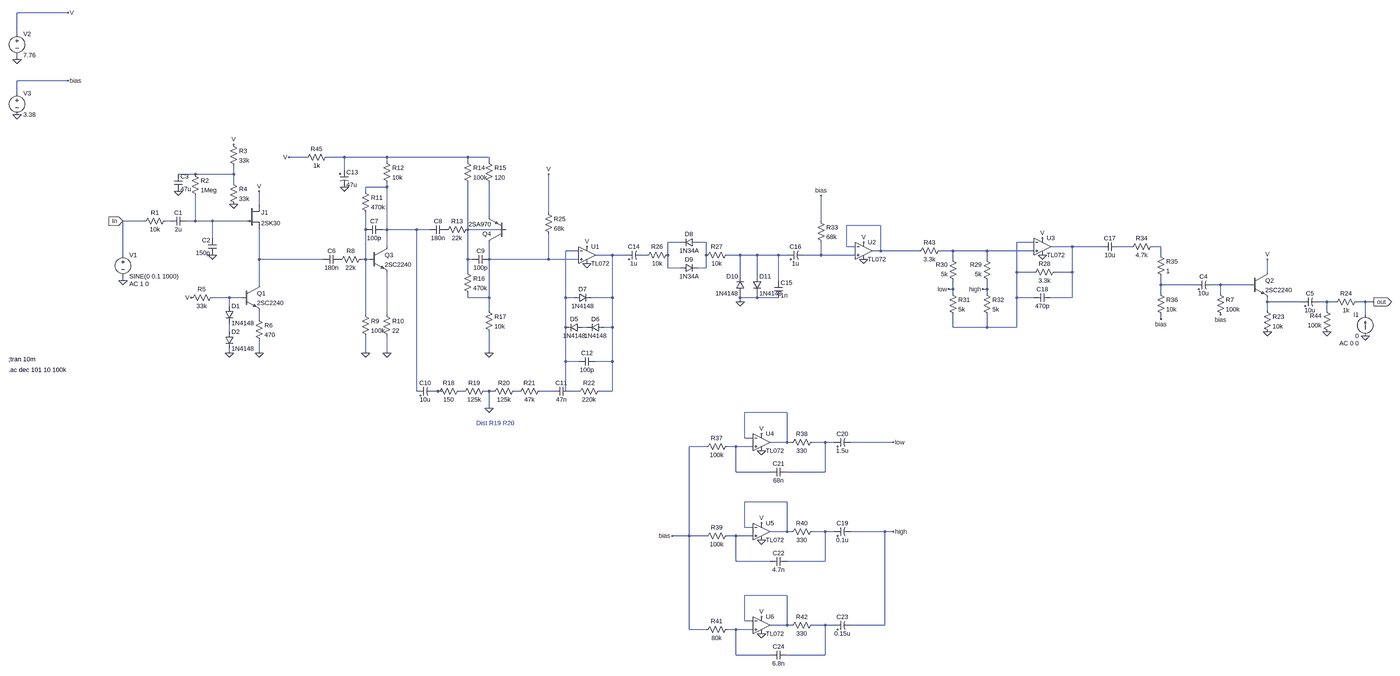
[diagram p0: schematic Narcissu.asc, whole sheet]
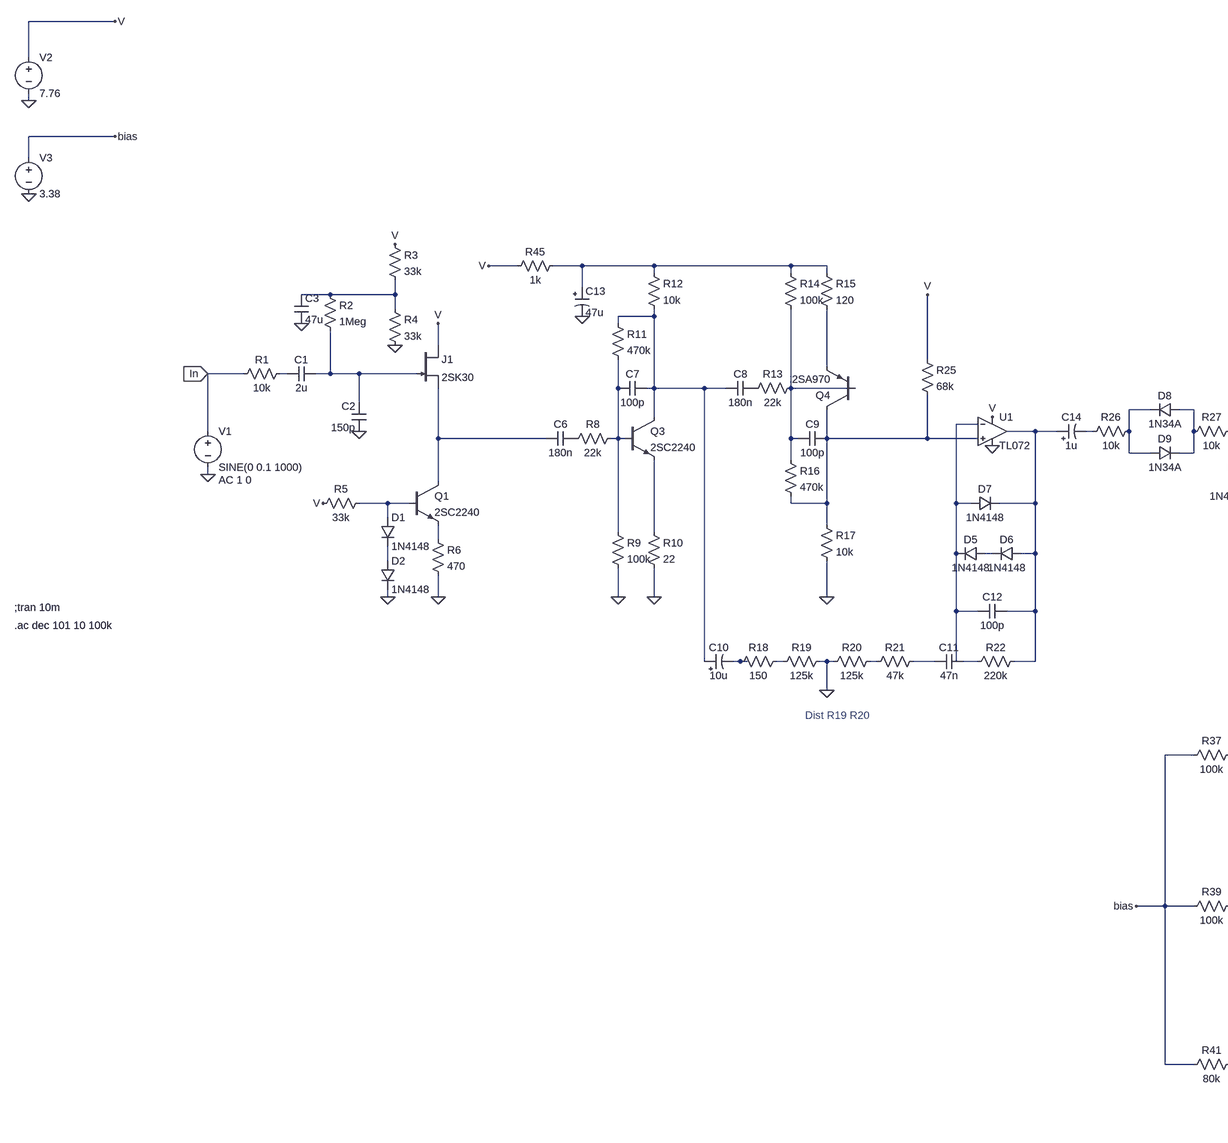
[diagram p1: schematic Narcissu.asc, part, row 1 of 1, column 1 of 2]
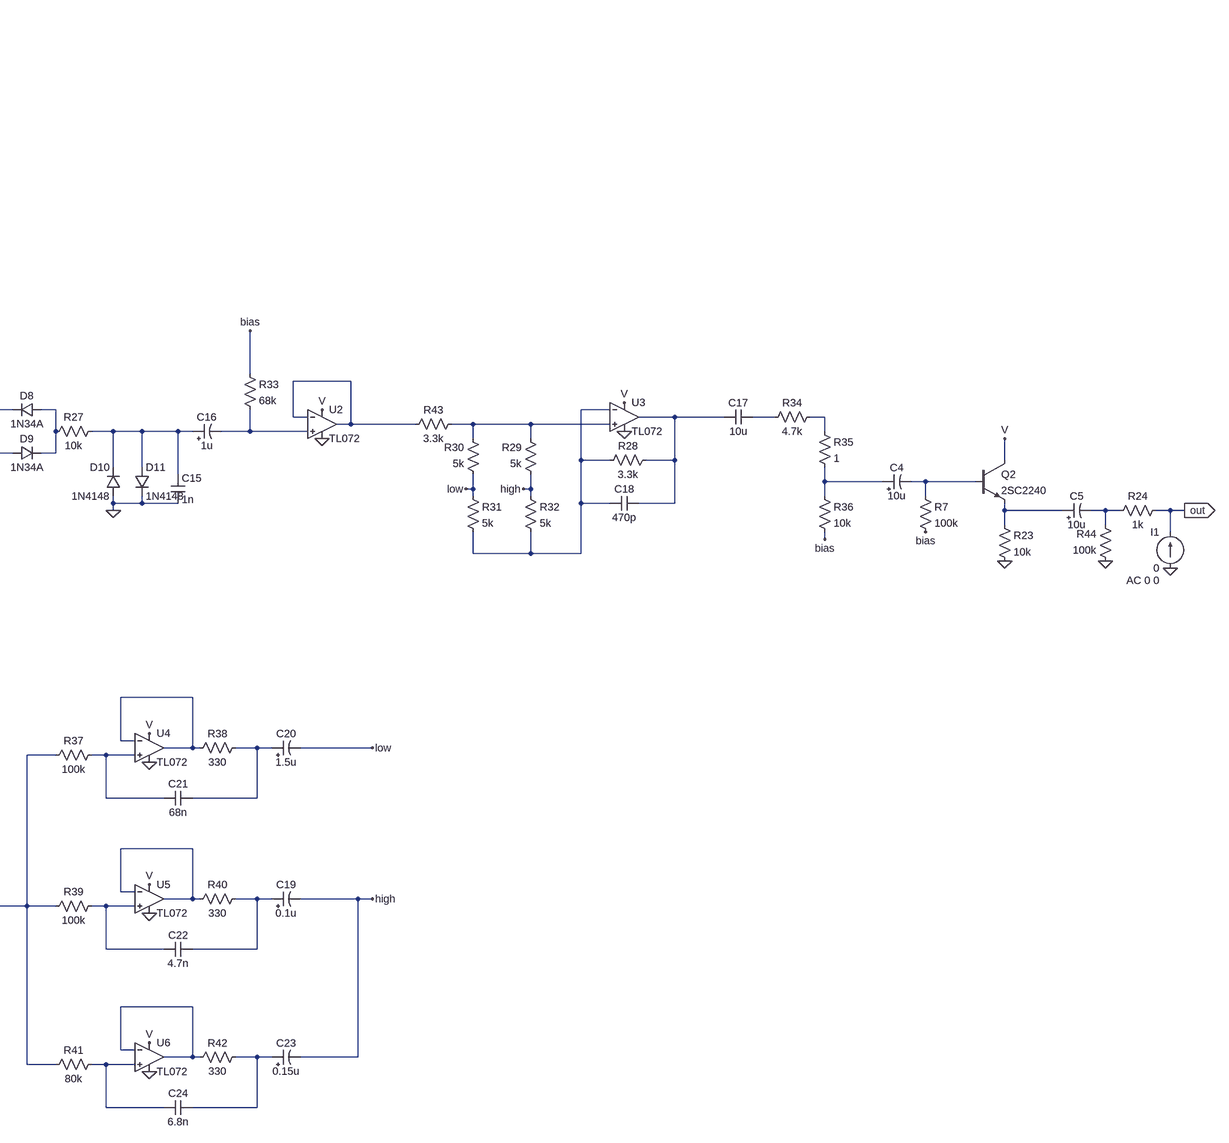
[diagram p2: schematic Narcissu.asc, part, row 1 of 1, column 2 of 2]
Narcissu.asc, the LTspice schematic file:
Version 4
SHEET 1 4928 1632
WIRE -224 -832 -416 -832
WIRE -416 -752 -416 -832
WIRE -416 -656 -416 -672
WIRE -224 -576 -416 -576
WIRE -416 -528 -416 -576
WIRE 672 -288 608 -288
WIRE 816 -288 752 -288
WIRE 976 -288 816 -288
WIRE 1280 -288 976 -288
WIRE 1360 -288 1280 -288
WIRE 976 -272 976 -288
WIRE 1280 -272 1280 -288
WIRE 1360 -272 1360 -288
WIRE 816 -240 816 -288
WIRE 256 -224 192 -224
WIRE 400 -224 400 -256
WIRE 400 -224 256 -224
WIRE 400 -192 400 -224
WIRE 976 -176 976 -192
WIRE 976 -176 896 -176
WIRE 896 -160 896 -176
WIRE 496 -112 496 -160
WIRE 1584 -80 1584 -224
WIRE 1360 -64 1360 -192
WIRE 64 -48 -16 -48
WIRE 160 -48 144 -48
WIRE 256 -48 256 -144
WIRE 256 -48 224 -48
WIRE 320 -48 256 -48
WIRE 448 -48 320 -48
WIRE 2608 -48 2608 -144
WIRE 2832 -32 2704 -32
WIRE 896 -16 896 -80
WIRE 976 -16 976 -176
WIRE 976 -16 960 -16
WIRE 1088 -16 976 -16
WIRE 1136 -16 1088 -16
WIRE 1280 -16 1280 -192
WIRE 1424 -16 1280 -16
WIRE 320 16 320 -48
WIRE 2080 32 2032 32
WIRE 2176 32 2144 32
WIRE 3408 32 3344 32
WIRE 976 48 976 -16
WIRE 2704 48 2704 -32
WIRE 2736 48 2704 48
WIRE 3552 48 3472 48
WIRE 3760 48 3552 48
WIRE 3872 48 3824 48
WIRE 3984 48 3952 48
WIRE 1696 64 1648 64
WIRE 2832 64 2832 -32
WIRE 2832 64 2800 64
WIRE 2976 64 2832 64
WIRE 3104 64 3056 64
WIRE 3232 64 3104 64
WIRE 3408 64 3232 64
WIRE -16 80 -16 -48
WIRE 1824 80 1760 80
WIRE 1872 80 1824 80
WIRE 1952 80 1936 80
WIRE 2032 80 2032 32
WIRE 2176 80 2176 32
WIRE 2304 80 2256 80
WIRE 2368 80 2304 80
WIRE 2448 80 2368 80
WIRE 2480 80 2448 80
WIRE 2608 80 2608 32
WIRE 2608 80 2544 80
WIRE 2736 80 2608 80
WIRE 3984 80 3984 48
WIRE 496 96 496 -16
WIRE 736 96 496 96
WIRE 896 96 896 -16
WIRE 896 96 880 96
WIRE 912 96 896 96
WIRE 1280 96 1280 -16
WIRE 1296 96 1280 96
WIRE 1360 96 1360 32
WIRE 1584 96 1584 0
WIRE 1584 96 1360 96
WIRE 1696 96 1584 96
WIRE 3104 96 3104 64
WIRE 3232 96 3232 64
WIRE 2032 128 2032 80
WIRE 2080 128 2032 128
WIRE 2176 128 2176 80
WIRE 2176 128 2144 128
WIRE 1280 144 1280 96
WIRE 3344 144 3344 32
WIRE 3408 144 3344 144
WIRE 3552 144 3552 48
WIRE 3552 144 3488 144
WIRE 4384 144 4384 96
WIRE 2304 160 2304 80
WIRE 2368 160 2368 80
WIRE -16 176 -16 160
WIRE 2448 176 2448 80
WIRE 496 192 496 96
WIRE 3984 192 3984 160
WIRE 4112 192 3984 192
WIRE 4208 192 4176 192
WIRE 4320 192 4208 192
WIRE 3104 208 3104 176
WIRE 3104 208 3088 208
WIRE 3232 208 3232 176
WIRE 3232 208 3216 208
WIRE 3104 224 3104 208
WIRE 3232 224 3232 208
WIRE 3984 224 3984 192
WIRE 4208 224 4208 192
WIRE 384 240 320 240
WIRE 432 240 384 240
WIRE 1280 240 1280 224
WIRE 1360 240 1360 96
WIRE 1360 240 1280 240
WIRE 1648 240 1648 64
WIRE 1680 240 1648 240
WIRE 1824 240 1824 80
WIRE 1824 240 1744 240
WIRE 2304 240 2304 224
WIRE 2368 240 2368 224
WIRE 2368 240 2304 240
WIRE 2448 240 2368 240
WIRE 3344 240 3344 144
WIRE 3408 240 3344 240
WIRE 3552 240 3552 144
WIRE 3552 240 3472 240
WIRE 2304 256 2304 240
WIRE 4384 256 4384 240
WIRE 4512 256 4384 256
WIRE 4608 256 4576 256
WIRE 4640 256 4608 256
WIRE 4752 256 4720 256
WIRE 4784 256 4752 256
WIRE 384 272 384 240
WIRE 1360 288 1360 240
WIRE 4384 288 4384 256
WIRE 4608 288 4608 256
WIRE 896 304 896 96
WIRE 976 304 976 144
WIRE 4752 304 4752 256
WIRE 496 320 496 288
WIRE 3984 320 3984 304
WIRE 1648 352 1648 240
WIRE 1728 352 1712 352
WIRE 1824 352 1824 240
WIRE 1824 352 1792 352
WIRE 3104 352 3104 304
WIRE 3232 352 3232 304
WIRE 3232 352 3104 352
WIRE 3344 352 3344 240
WIRE 3344 352 3232 352
WIRE 384 368 384 336
WIRE 384 448 384 432
WIRE 496 448 496 400
WIRE 896 448 896 384
WIRE 976 448 976 384
WIRE 1360 448 1360 368
WIRE 1648 480 1648 352
WIRE 1696 480 1648 480
WIRE 1824 480 1824 352
WIRE 1824 480 1760 480
WIRE 1088 592 1088 -16
WIRE 1168 592 1152 592
WIRE 1184 592 1168 592
WIRE 1264 592 1248 592
WIRE 1360 592 1344 592
WIRE 1376 592 1360 592
WIRE 1472 592 1456 592
WIRE 1600 592 1552 592
WIRE 1648 592 1648 480
WIRE 1696 592 1664 592
WIRE 1824 592 1824 480
WIRE 1824 592 1776 592
WIRE 1360 656 1360 592
WIRE 2480 672 2320 672
WIRE 2320 768 2320 672
WIRE 2352 768 2320 768
WIRE 2480 784 2480 672
WIRE 2480 784 2416 784
WIRE 2496 784 2480 784
WIRE 2624 784 2576 784
WIRE 2656 784 2624 784
WIRE 2880 784 2720 784
WIRE 2176 800 2112 800
WIRE 2288 800 2256 800
WIRE 2352 800 2288 800
WIRE 2288 896 2288 800
WIRE 2416 896 2288 896
WIRE 2624 896 2624 784
WIRE 2624 896 2480 896
WIRE 2480 1008 2320 1008
WIRE 2320 1104 2320 1008
WIRE 2352 1104 2320 1104
WIRE 2480 1120 2480 1008
WIRE 2480 1120 2416 1120
WIRE 2496 1120 2480 1120
WIRE 2624 1120 2576 1120
WIRE 2656 1120 2624 1120
WIRE 2848 1120 2720 1120
WIRE 2880 1120 2848 1120
WIRE 2112 1136 2112 800
WIRE 2112 1136 2048 1136
WIRE 2176 1136 2112 1136
WIRE 2288 1136 2256 1136
WIRE 2352 1136 2288 1136
WIRE 2288 1232 2288 1136
WIRE 2416 1232 2288 1232
WIRE 2624 1232 2624 1120
WIRE 2624 1232 2480 1232
WIRE 2480 1360 2320 1360
WIRE 2320 1456 2320 1360
WIRE 2352 1456 2320 1456
WIRE 2480 1472 2480 1360
WIRE 2480 1472 2416 1472
WIRE 2496 1472 2480 1472
WIRE 2624 1472 2576 1472
WIRE 2656 1472 2624 1472
WIRE 2848 1472 2848 1120
WIRE 2848 1472 2720 1472
WIRE 2112 1488 2112 1136
WIRE 2176 1488 2112 1488
WIRE 2288 1488 2256 1488
WIRE 2352 1488 2288 1488
WIRE 2288 1584 2288 1488
WIRE 2416 1584 2288 1584
WIRE 2624 1584 2624 1472
WIRE 2624 1584 2480 1584
FLAG -16 176 0
FLAG 192 -160 0
FLAG 400 -112 0
FLAG 320 80 0
FLAG 384 448 0
FLAG 496 448 0
FLAG -416 -656 0
FLAG 240 240 V
FLAG 496 -160 V
FLAG 400 -336 V
FLAG 896 448 0
FLAG 976 448 0
FLAG 1360 448 0
FLAG 2304 256 0
FLAG 1360 656 0
FLAG 3216 208 high
FLAG 3088 208 low
FLAG 2768 96 0
FLAG 1728 112 0
FLAG 3440 80 0
FLAG 2768 32 V
FLAG 3440 16 V
FLAG 1728 48 V
FLAG 2608 -144 bias
FLAG 2048 1136 bias
FLAG 2384 816 0
FLAG 2384 1152 0
FLAG 2384 1504 0
FLAG 2384 752 V
FLAG 2384 1088 V
FLAG 2384 1440 V
FLAG 2880 784 low
FLAG 2880 1120 high
FLAG 608 -288 V
FLAG 1584 -224 V
FLAG -224 -832 V
FLAG -416 -448 0
FLAG -224 -576 bias
FLAG 4384 368 0
FLAG 4608 368 0
FLAG 4384 96 V
FLAG 4208 304 bias
FLAG 3984 320 bias
FLAG 816 -176 0
FLAG 4784 256 out
IOPIN 4784 256 Out
FLAG 4752 384 0
FLAG -16 -48 In
IOPIN -16 -48 In
DATAFLAG 1536 96 ""
DATAFLAG 976 176 ""
DATAFLAG 896 96 ""
DATAFLAG 496 96 ""
DATAFLAG 912 -176 ""
DATAFLAG 992 -16 ""
DATAFLAG 896 -288 ""
DATAFLAG 656 -288 ""
DATAFLAG 400 -48 ""
DATAFLAG 1584 -176 ""
DATAFLAG 2608 80 ""
SYMBOL voltage -16 64 R0
WINDOW 123 24 124 Left 2
WINDOW 39 0 0 Left 0
SYMATTR Value2 AC 1 0
SYMATTR InstName V1
SYMATTR Value SINE(0 0.1 1000)
SYMBOL res 160 -64 R90
WINDOW 0 0 56 VBottom 2
WINDOW 3 32 56 VTop 2
SYMATTR InstName R1
SYMATTR Value 10k
SYMBOL cap 224 -64 R90
WINDOW 0 0 32 VBottom 2
WINDOW 3 32 32 VTop 2
SYMATTR InstName C1
SYMATTR Value 2u
SYMBOL cap 336 80 R180
WINDOW 0 24 56 Left 2
WINDOW 3 24 8 Left 2
SYMATTR InstName C2
SYMATTR Value 150p
SYMBOL res 240 -240 R0
SYMATTR InstName R2
SYMATTR Value 1Meg
SYMBOL res 384 -352 R0
SYMATTR InstName R3
SYMATTR Value 33k
SYMBOL res 384 -208 R0
SYMATTR InstName R4
SYMATTR Value 33k
SYMBOL cap 176 -224 R0
SYMATTR InstName C3
SYMATTR Value 47u
SYMBOL njf 448 -112 R0
SYMATTR InstName J1
SYMATTR Value 2SK30
SYMBOL npn 432 192 R0
SYMATTR InstName Q1
SYMATTR Value 2SC2240
SYMBOL res 336 224 R90
WINDOW 0 0 56 VBottom 2
WINDOW 3 32 56 VTop 2
SYMATTR InstName R5
SYMATTR Value 33k
SYMBOL diode 368 272 R0
SYMATTR InstName D1
SYMATTR Value 1N4148
SYMBOL diode 368 368 R0
SYMATTR InstName D2
SYMATTR Value 1N4148
SYMBOL res 480 304 R0
SYMATTR InstName R6
SYMATTR Value 470
SYMBOL voltage -416 -768 R0
WINDOW 123 0 0 Left 0
WINDOW 39 0 0 Left 0
SYMATTR InstName V2
SYMATTR Value 7.76
SYMBOL cap 800 80 R90
WINDOW 0 0 32 VBottom 2
WINDOW 3 32 32 VTop 2
SYMATTR InstName C6
SYMATTR Value 180n
SYMBOL res 896 80 R90
WINDOW 0 0 56 VBottom 2
WINDOW 3 32 56 VTop 2
SYMATTR InstName R8
SYMATTR Value 22k
SYMBOL npn 912 48 R0
SYMATTR InstName Q3
SYMATTR Value 2SC2240
SYMBOL res 880 288 R0
SYMATTR InstName R9
SYMATTR Value 100k
SYMBOL res 960 288 R0
SYMATTR InstName R10
SYMATTR Value 22
SYMBOL res 880 -176 R0
SYMATTR InstName R11
SYMATTR Value 470k
SYMBOL cap 960 -32 R90
WINDOW 0 0 32 VBottom 2
WINDOW 3 32 32 VTop 2
SYMATTR InstName C7
SYMATTR Value 100p
SYMBOL res 960 -288 R0
SYMATTR InstName R12
SYMATTR Value 10k
SYMBOL cap 1200 -32 R90
WINDOW 0 0 32 VBottom 2
WINDOW 3 32 32 VTop 2
SYMATTR InstName C8
SYMATTR Value 180n
SYMBOL res 1296 -32 R90
WINDOW 0 0 56 VBottom 2
WINDOW 3 32 56 VTop 2
SYMATTR InstName R13
SYMATTR Value 22k
SYMBOL pnp 1424 32 R180
SYMATTR InstName Q4
SYMATTR Value 2SA970
SYMBOL res 1264 -288 R0
SYMATTR InstName R14
SYMATTR Value 100k
SYMBOL res 1344 -288 R0
SYMATTR InstName R15
SYMATTR Value 120
SYMBOL res 1264 128 R0
SYMATTR InstName R16
SYMATTR Value 470k
SYMBOL res 1344 272 R0
SYMATTR InstName R17
SYMATTR Value 10k
SYMBOL cap 1360 80 R90
WINDOW 0 0 32 VBottom 2
WINDOW 3 32 32 VTop 2
SYMATTR InstName C9
SYMATTR Value 100p
SYMBOL res 1360 576 R90
WINDOW 0 0 56 VBottom 2
WINDOW 3 32 56 VTop 2
SYMATTR InstName R19
SYMATTR Value 125k
SYMBOL res 1472 576 R90
WINDOW 0 0 56 VBottom 2
WINDOW 3 32 56 VTop 2
SYMATTR InstName R20
SYMATTR Value 125k
SYMBOL res 1568 576 R90
WINDOW 0 0 56 VBottom 2
WINDOW 3 32 56 VTop 2
SYMATTR InstName R21
SYMATTR Value 47k
SYMBOL res 1792 576 R90
WINDOW 0 0 56 VBottom 2
WINDOW 3 32 56 VTop 2
SYMATTR InstName R22
SYMATTR Value 220k
SYMBOL cap 1664 576 R90
WINDOW 0 0 32 VBottom 2
WINDOW 3 32 32 VTop 2
SYMATTR InstName C11
SYMATTR Value 47n
SYMBOL cap 1760 464 R90
WINDOW 0 0 32 VBottom 2
WINDOW 3 32 32 VTop 2
SYMATTR InstName C12
SYMATTR Value 100p
SYMBOL diode 1712 336 R90
WINDOW 0 0 32 VBottom 2
WINDOW 3 32 32 VTop 2
SYMATTR InstName D5
SYMATTR Value 1N4148
SYMBOL diode 1792 336 R90
WINDOW 0 0 32 VBottom 2
WINDOW 3 32 32 VTop 2
SYMATTR InstName D6
SYMATTR Value 1N4148
SYMBOL diode 1680 256 R270
WINDOW 0 32 32 VTop 2
WINDOW 3 0 32 VBottom 2
SYMATTR InstName D7
SYMATTR Value 1N4148
SYMBOL OpAmps\\TL072 1728 16 R0
SYMATTR InstName U1
SYMBOL res 1568 -96 R0
SYMATTR InstName R25
SYMATTR Value 68k
SYMBOL polcap 1872 96 R270
WINDOW 0 32 32 VTop 2
WINDOW 3 0 32 VBottom 2
SYMATTR InstName C14
SYMATTR Value 1u
SYMBOL res 2048 64 R90
WINDOW 0 0 56 VBottom 2
WINDOW 3 32 56 VTop 2
SYMATTR InstName R26
SYMATTR Value 10k
SYMBOL diode 2144 16 R90
WINDOW 0 0 32 VBottom 2
WINDOW 3 32 32 VTop 2
SYMATTR InstName D8
SYMATTR Value 1N34A
SYMBOL diode 2080 144 R270
WINDOW 0 32 32 VTop 2
WINDOW 3 0 32 VBottom 2
SYMATTR InstName D9
SYMATTR Value 1N34A
SYMBOL diode 2320 224 R180
WINDOW 0 24 64 Left 2
WINDOW 3 24 0 Left 2
SYMATTR InstName D10
SYMATTR Value 1N4148
SYMBOL diode 2352 160 R0
SYMATTR InstName D11
SYMATTR Value 1N4148
SYMBOL res 2272 64 R90
WINDOW 0 0 56 VBottom 2
WINDOW 3 32 56 VTop 2
SYMATTR InstName R27
SYMATTR Value 10k
SYMBOL cap 2432 176 R0
SYMATTR InstName C15
SYMATTR Value 1n
SYMBOL OpAmps\\TL072 2768 0 R0
SYMATTR InstName U2
SYMBOL OpAmps\\TL072 3440 -16 R0
SYMATTR InstName U3
SYMBOL res 3504 128 R90
WINDOW 0 0 56 VBottom 2
WINDOW 3 32 56 VTop 2
SYMATTR InstName R28
SYMATTR Value 3.3k
SYMBOL res 3248 192 R180
WINDOW 0 36 76 Left 2
WINDOW 3 36 40 Left 2
SYMATTR InstName R29
SYMATTR Value 5k
SYMBOL res 3120 192 R180
WINDOW 0 36 76 Left 2
WINDOW 3 36 40 Left 2
SYMATTR InstName R30
SYMATTR Value 5k
SYMBOL res 3088 208 R0
SYMATTR InstName R31
SYMATTR Value 5k
SYMBOL res 3216 208 R0
SYMATTR InstName R32
SYMATTR Value 5k
SYMBOL polcap 2480 96 R270
WINDOW 0 32 32 VTop 2
WINDOW 3 0 32 VBottom 2
SYMATTR InstName C16
SYMATTR Value 1u
SYMBOL res 2592 -64 R0
SYMATTR InstName R33
SYMATTR Value 68k
SYMBOL cap 3824 32 R90
WINDOW 0 0 32 VBottom 2
WINDOW 3 32 32 VTop 2
SYMATTR InstName C17
SYMATTR Value 10u
SYMBOL res 3968 32 R90
WINDOW 0 0 56 VBottom 2
WINDOW 3 32 56 VTop 2
SYMATTR InstName R34
SYMATTR Value 4.7k
SYMBOL res 3968 64 R0
SYMATTR InstName R35
SYMATTR Value 1
SYMBOL res 3968 208 R0
SYMATTR InstName R36
SYMATTR Value 10k
SYMBOL cap 3472 224 R90
WINDOW 0 0 32 VBottom 2
WINDOW 3 32 32 VTop 2
SYMATTR InstName C18
SYMATTR Value 470p
SYMBOL OpAmps\\TL072 2384 720 R0
SYMATTR InstName U4
SYMBOL res 2272 784 R90
WINDOW 0 0 56 VBottom 2
WINDOW 3 32 56 VTop 2
SYMATTR InstName R37
SYMATTR Value 100k
SYMBOL res 2592 768 R90
WINDOW 0 0 56 VBottom 2
WINDOW 3 32 56 VTop 2
SYMATTR InstName R38
SYMATTR Value 330
SYMBOL polcap 2656 800 R270
WINDOW 0 32 32 VTop 2
WINDOW 3 0 32 VBottom 2
SYMATTR InstName C20
SYMATTR Value 1.5u
SYMBOL cap 2480 880 R90
WINDOW 0 0 32 VBottom 2
WINDOW 3 32 32 VTop 2
SYMATTR InstName C21
SYMATTR Value 68n
SYMBOL OpAmps\\TL072 2384 1056 R0
SYMATTR InstName U5
SYMBOL res 2272 1120 R90
WINDOW 0 0 56 VBottom 2
WINDOW 3 32 56 VTop 2
SYMATTR InstName R39
SYMATTR Value 100k
SYMBOL res 2592 1104 R90
WINDOW 0 0 56 VBottom 2
WINDOW 3 32 56 VTop 2
SYMATTR InstName R40
SYMATTR Value 330
SYMBOL polcap 2656 1136 R270
WINDOW 0 32 32 VTop 2
WINDOW 3 0 32 VBottom 2
SYMATTR InstName C19
SYMATTR Value 0.1u
SYMBOL cap 2480 1216 R90
WINDOW 0 0 32 VBottom 2
WINDOW 3 32 32 VTop 2
SYMATTR InstName C22
SYMATTR Value 4.7n
SYMBOL OpAmps\\TL072 2384 1408 R0
SYMATTR InstName U6
SYMBOL res 2272 1472 R90
WINDOW 0 0 56 VBottom 2
WINDOW 3 32 56 VTop 2
SYMATTR InstName R41
SYMATTR Value 80k
SYMBOL res 2592 1456 R90
WINDOW 0 0 56 VBottom 2
WINDOW 3 32 56 VTop 2
SYMATTR InstName R42
SYMATTR Value 330
SYMBOL polcap 2656 1488 R270
WINDOW 0 32 32 VTop 2
WINDOW 3 0 32 VBottom 2
SYMATTR InstName C23
SYMATTR Value 0.15u
SYMBOL cap 2480 1568 R90
WINDOW 0 0 32 VBottom 2
WINDOW 3 32 32 VTop 2
SYMATTR InstName C24
SYMATTR Value 6.8n
SYMBOL res 3072 48 R90
WINDOW 0 0 56 VBottom 2
WINDOW 3 32 56 VTop 2
SYMATTR InstName R43
SYMATTR Value 3.3k
SYMBOL voltage -416 -544 R0
WINDOW 123 0 0 Left 0
WINDOW 39 0 0 Left 0
SYMATTR InstName V3
SYMATTR Value 3.38
SYMBOL polcap 4112 208 R270
WINDOW 0 32 32 VTop 2
WINDOW 3 0 32 VBottom 2
SYMATTR InstName C4
SYMATTR Value 10u
SYMBOL res 4192 208 R0
SYMATTR InstName R7
SYMATTR Value 100k
SYMBOL npn 4320 144 R0
SYMATTR InstName Q2
SYMATTR Value 2SC2240
SYMBOL res 4368 272 R0
SYMATTR InstName R23
SYMATTR Value 10k
SYMBOL res 4736 240 R90
WINDOW 0 0 56 VBottom 2
WINDOW 3 32 56 VTop 2
SYMATTR InstName R24
SYMATTR Value 1k
SYMBOL res 4624 384 R180
WINDOW 0 36 76 Left 2
WINDOW 3 36 40 Left 2
SYMATTR InstName R44
SYMATTR Value 100k
SYMBOL polcap 4512 272 R270
WINDOW 0 32 32 VTop 2
WINDOW 3 0 32 VBottom 2
SYMATTR InstName C5
SYMATTR Value 10u
SYMBOL res 768 -304 R90
WINDOW 0 0 56 VBottom 2
WINDOW 3 32 56 VTop 2
SYMATTR InstName R45
SYMATTR Value 1k
SYMBOL polcap 800 -240 R0
SYMATTR InstName C13
SYMATTR Value 47u
SYMBOL polcap 1088 608 R270
WINDOW 0 32 32 VTop 2
WINDOW 3 0 32 VBottom 2
SYMATTR InstName C10
SYMATTR Value 10u
SYMBOL res 1264 576 R90
WINDOW 0 0 56 VBottom 2
WINDOW 3 32 56 VTop 2
SYMATTR InstName R18
SYMATTR Value 150
SYMBOL current 4752 384 R180
WINDOW 0 24 80 Left 2
WINDOW 3 24 0 Left 2
WINDOW 123 24 -28 Left 2
WINDOW 39 0 0 Left 0
SYMATTR InstName I1
SYMATTR Value 0
SYMATTR Value2 AC 0 0
TEXT -448 472 Left 2 !;tran 10m
TEXT -448 512 Left 2 !.ac dec 101 10 100k
TEXT 1312 712 Left 2 ;Dist R19 R20

The netlist it stands for:
* Narcissu.asc
V1 In 0 SINE(0 0.1 1000) AC 1 0
R1 N005 In 10k
C1 N006 N005 2u
C2 0 N006 150p
R2 N002 N006 1Meg
R3 V N002 33k
R4 N002 0 33k
C3 N002 0 47u
J1 V N006 N022 2SK30
Q1 N022 N026 N030 0 2SC2240
R5 N026 V 33k
D1 N026 N032 1N4148
D2 N032 0 1N4148
R6 N030 0 470
V2 V 0 7.76
C6 P001 N022 180n
R8 N008 P001 22k
Q3 N003 N008 N029 0 2SC2240
R9 N008 0 100k
R10 N029 0 22
R11 N003 N008 470k
C7 N003 N008 100p
R12 N001 N003 10k
C8 P002 N003 180n
R13 N009 P002 22k
Q4 N023 N009 N004 0 2SA970
R14 N001 N009 100k
R15 N001 N004 120
R16 N009 N023 470k
R17 N023 0 10k
C9 N023 N009 100p
R19 0 N034 125k
R20 N035 0 125k
R21 N036 N035 47k
R22 N018 N037 220k
C11 N037 N036 47n
C12 N018 N016 100p
D5 N031 N016 1N4148
D6 N018 N031 1N4148
D7 N016 N018 1N4148
XU1 N023 N016 V 0 N018 TL072  ; pins In+ In- V+ V- OUT
R25 V N023 68k
C14 N018 N019 1u
R26 N010 N019 10k
D8 N011 N010 1N34A
D9 N010 N011 1N34A
D10 0 N020 1N4148
D11 N020 0 1N4148
R27 N020 N011 10k
C15 N020 0 1n
XU2 N021 N007 V 0 N007 TL072  ; pins In+ In- V+ V- OUT
XU3 N017 N012 V 0 N013 TL072  ; pins In+ In- V+ V- OUT
R28 N013 N012 3.3k
R29 high N017 5k
R30 low N017 5k
R31 low N012 5k
R32 high N012 5k
C16 N020 N021 1u
R33 bias N021 68k
C17 N014 N013 10u
R34 N015 N014 4.7k
R35 N015 N024 1
R36 N024 bias 10k
C18 N013 N012 470p
XU4 N040 N038 V 0 N038 TL072  ; pins In+ In- V+ V- OUT
R37 N040 bias 100k
R38 N039 N038 330
C20 N039 low 1.5u
C21 N039 N040 68n
XU5 N043 N041 V 0 N041 TL072  ; pins In+ In- V+ V- OUT
R39 N043 bias 100k
R40 N042 N041 330
C19 N042 high 0.1u
C22 N042 N043 4.7n
XU6 N046 N044 V 0 N044 TL072  ; pins In+ In- V+ V- OUT
R41 N046 bias 80k
R42 N045 N044 330
C23 N045 high 0.15u
C24 N045 N046 6.8n
R43 N017 N007 3.3k
V3 bias 0 3.38
C4 N024 N025 10u
R7 N025 bias 100k
Q2 V N025 N027 0 2SC2240
R23 N027 0 10k
R24 out N028 1k
R44 0 N028 100k
C5 N027 N028 10u
R45 N001 V 1k
C13 N001 0 47u
C10 N003 N033 10u
R18 N034 N033 150
I1 0 out 0 AC 0 0
.model D D
.lib standard.dio
.model NPN NPN
.model PNP PNP
.lib standard.bjt
.model NJF NJF
.model PJF PJF
.lib standard.jft
;tran 10m
.ac dec 101 10 100k
* Dist R19 R20
.backanno
.end